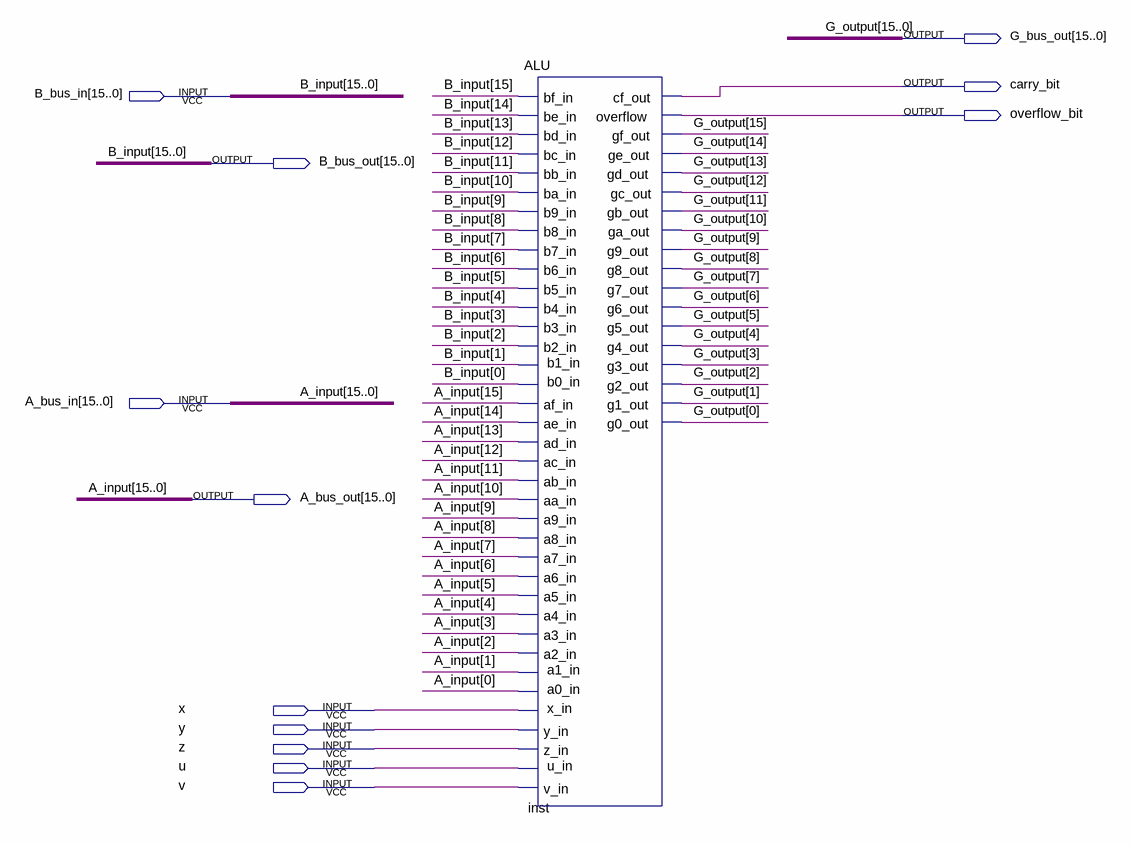
[diagram p0: schematic sheet]
// Quartus schematic ALU_interface.bdf as structural Verilog: 1 symbols, 12 pins
module ALU_interface (
  input  [15:0] B_bus_in,
  input  [15:0] A_bus_in,
  input  x,
  input  y,
  input  z,
  input  u,
  input  v,
  output [15:0] G_bus_out,
  output carry_bit,
  output overflow_bit,
  output [15:0] B_bus_out,
  output [15:0] A_bus_out
);

  ALU inst (
    .b1_in(B_bus_in[1]), .b0_in(B_bus_in[0]), .bf_in(B_bus_in[15]), .be_in(B_bus_in[14]),
    .bd_in(B_bus_in[13]), .bc_in(B_bus_in[12]), .bb_in(B_bus_in[11]), .b9_in(B_bus_in[9]),
    .b8_in(B_bus_in[8]), .b7_in(B_bus_in[7]), .b6_in(B_bus_in[6]), .b5_in(B_bus_in[5]), .b4_in(B_bus_in[4]),
    .b3_in(B_bus_in[3]), .b2_in(B_bus_in[2]), .ba_in(B_bus_in[10]), .x_in(x), .af_in(A_bus_in[15]),
    .ae_in(A_bus_in[14]), .ad_in(A_bus_in[13]), .ac_in(A_bus_in[12]), .a1_in(A_bus_in[1]),
    .a0_in(A_bus_in[0]), .ab_in(A_bus_in[11]), .aa_in(A_bus_in[10]), .a9_in(A_bus_in[9]),
    .a8_in(A_bus_in[8]), .a7_in(A_bus_in[7]), .a6_in(A_bus_in[6]), .a5_in(A_bus_in[5]), .a4_in(A_bus_in[4]),
    .a3_in(A_bus_in[3]), .a2_in(A_bus_in[2]), .u_in(u), .z_in(z), .y_in(y), .v_in(v), .cf_out(carry_bit),
    .overflow(overflow_bit), .gf_out(G_bus_out[15]), .ge_out(G_bus_out[14]), .gd_out(G_bus_out[13]),
    .gc_out(G_bus_out[12]), .gb_out(G_bus_out[11]), .ga_out(G_bus_out[10]), .g9_out(G_bus_out[9]),
    .g8_out(G_bus_out[8]), .g7_out(G_bus_out[7]), .g6_out(G_bus_out[6]), .g5_out(G_bus_out[5]),
    .g4_out(G_bus_out[4]), .g3_out(G_bus_out[3]), .g2_out(G_bus_out[2]), .g1_out(G_bus_out[1]),
    .g0_out(G_bus_out[0]));

  assign A_bus_out = A_bus_in;
  assign B_bus_out = B_bus_in;

  // Other names for the same wires on the sheet: A_input[15:0] = A_bus_in; B_input[15:0] = B_bus_in;
  //   G_output[15:0] = G_bus_out
endmodule
